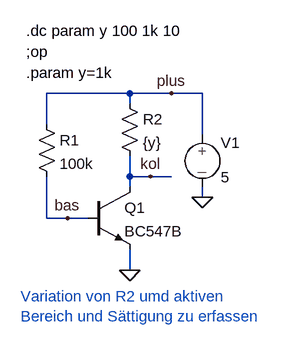
[diagram p0: schematic Q1-2.asc]
Q1-2.asc, the LTspice schematic file:
Version 4
SHEET 1 880 680
WIRE 224 -16 96 -16
WIRE 288 -16 224 -16
WIRE 336 -16 288 -16
WIRE 224 0 224 -16
WIRE 96 32 96 -16
WIRE 336 48 336 -16
WIRE 224 112 224 80
WIRE 256 112 224 112
WIRE 288 112 256 112
WIRE 224 128 224 112
WIRE 336 144 336 128
WIRE 96 176 96 112
WIRE 128 176 96 176
WIRE 160 176 128 176
WIRE 224 256 224 224
FLAG 224 256 0
FLAG 336 144 0
FLAG 288 -16 plus
FLAG 256 112 kol
FLAG 128 176 bas
SYMBOL EIT_Semiconductors\\npn 160 128 R0
SYMATTR InstName Q1
SYMATTR Value BC547B
SYMBOL res 80 16 R0
SYMATTR InstName R1
SYMATTR Value 100k
SYMBOL res 208 -16 R0
SYMATTR InstName R2
SYMATTR Value {y}
SYMBOL source-V 336 32 R0
SYMATTR InstName V1
SYMATTR Value 5
TEXT 64 -80 Left 2 !;op
TEXT 64 -112 Left 2 !.dc param y 100 1k 10
TEXT 64 -48 Left 2 !.param y=1k
TEXT 56 296 Left 2 ;Variation von R2 umd aktiven\nBereich und Sättigung zu erfassen

The netlist it stands for:
* Q1-2.asc
Q1 kol bas 0 0 BC547B
R1 plus bas 100k
R2 plus kol {y}
V1 plus 0 5
.model NPN NPN
.model PNP PNP
.lib standard.bjt
;op
.dc param y 100 1k 10
.param y=1k
* Variation von R2 umd aktiven
* Bereich und Sättigung zu erfassen
.backanno
.end